# Altium schematic sheet Scheme.SchDoc
size A4
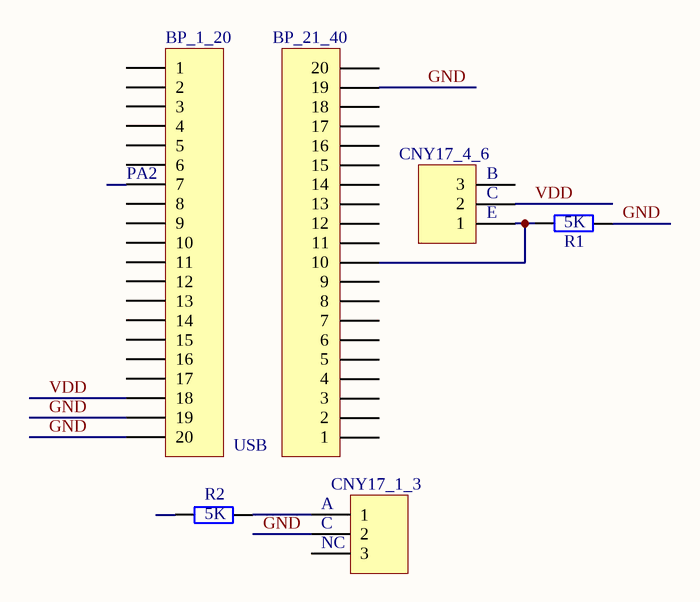
[diagram p0: Scheme.SchDoc]

## Parts
BP_1_20  Header 20  [HDR1X20]  (value not drawn)
BP_21_40  Header 20  [HDR1X20]  (value not drawn)
CNY17_1_3  Header 3  [HDR1X3]  (value not drawn)
CNY17_4_6  Header 3  [HDR1X3]  (value not drawn)
R1  5k  [AXIAL-0.4]
R2  5k  [AXIAL-0.4]

## Nets
GND: BP_1_20.19 BP_1_20.20 BP_21_40.19 CNY17_1_3.2 R1.2
VDD: BP_1_20.18 CNY17_4_6.2
NetBP_21_40_10: BP_21_40.10 CNY17_4_6.1 R1.1
NetCNY17_1_3_1: CNY17_1_3.1 R2.2

Not connected (* = marked no-connect by the designer): BP_1_20 1 2 3 4 5 6 7 8 9 10 11 12 13 14 15 16 17; BP_21_40 1 2 3 4 5 6 7 8 9 11 12 13 14 15 16 17 18 20; CNY17_1_3 3; CNY17_4_6 3; R2 1

## Notes on the sheet
- (near BP_1_20) PA2
- (near CNY17_4_6) E
- (near CNY17_4_6) C
- (near CNY17_4_6) B
- USB
- (near CNY17_1_3) A
- (near CNY17_1_3) C
- (near CNY17_1_3) NC

## Library data of the parts
BP_1_20 BP_21_40 = Header 20: Header, 20-Pin; LatestRevisionDate: 17-Jul-2002; LatestRevisionNote: Re-released for DXP Platform.; Publisher: Altium Limited
CNY17_1_3 CNY17_4_6 = Header 3: Header, 3-Pin; LatestRevisionDate: 17-Jul-2002; LatestRevisionNote: Re-released for DXP Platform.; Publisher: Altium Limited
R1 R2 = Res2: Resistor; Published: 8-Jun-2000; LatestRevisionDate: 17-Jul-2002; LatestRevisionNote: Re-released for DXP Platform.; PackageReference: AXIAL-0.4; Publisher: Altium Limited; PackageDescription: Axial Device, Thru-Hole; 2 Leads; 0.4 in Pin Spacing; Value: 5K